# EAGLE design DummyLoad (EAGLE 7.3.0)
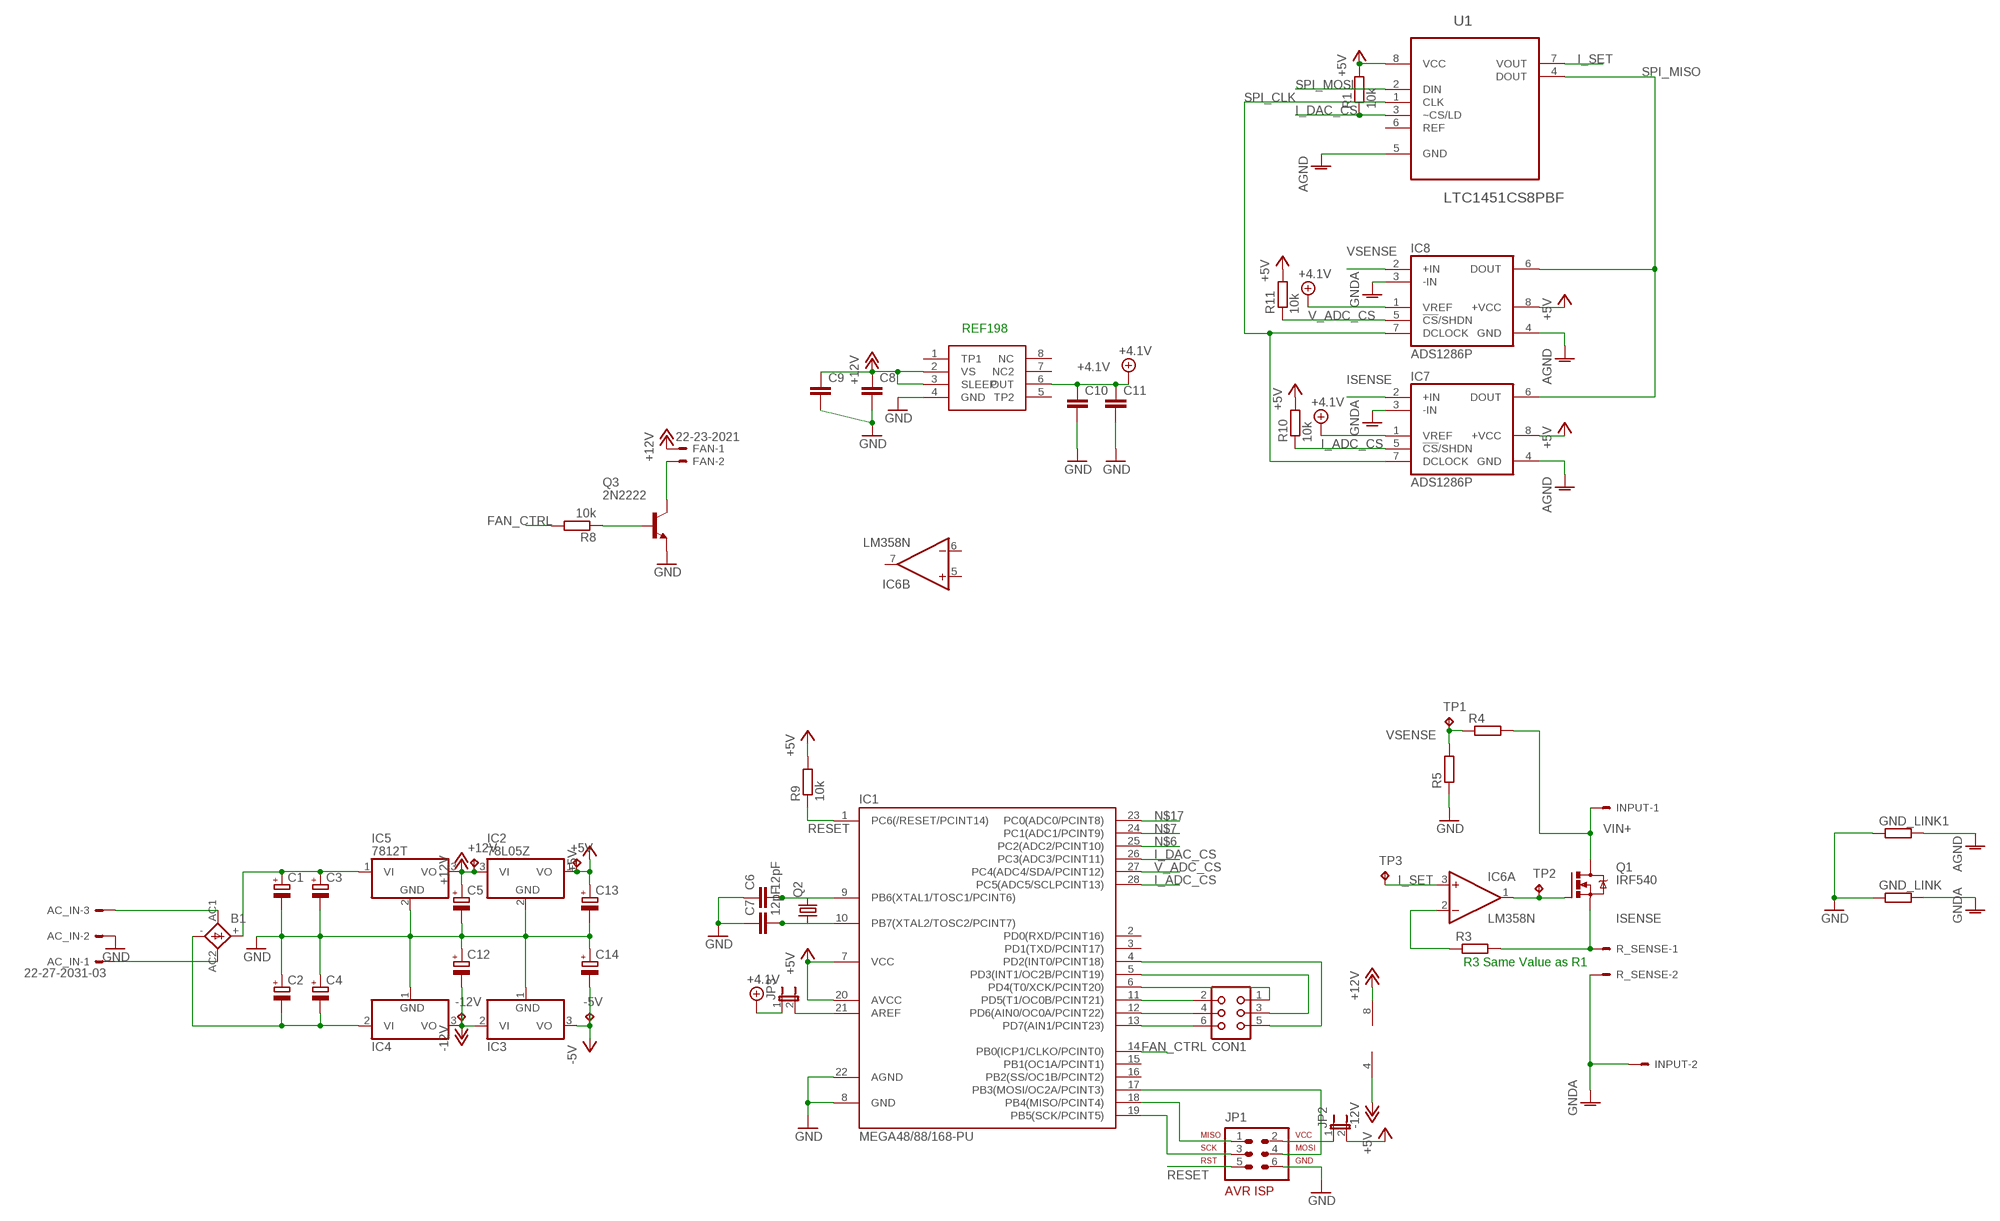
[diagram p0: schematic, sheet 1]

## Parts
+5V  TPB2,54  [B2,54]
+12V  TPB2,54  [B2,54]
-5V  TPB2,54  [B2,54]
-12V  TPB2,54  [B2,54]
AC_IN  22-27-2031-03  [6410-03]
B1  2KBB-R  [2KBB-R]
C1  CPOL-EUE5-8.5  [E5-8,5]
C2  CPOL-EUE5-8.5  [E5-8,5]
C3  CPOL-EUE5-8.5  [E5-8,5]
C4  CPOL-EUE5-8.5  [E5-8,5]
C5  CPOL-EUE2,5-6E  [E2,5-6E]
C6  12pF  C-EUC1206K  [C1206K]
C7  12pF  C-EUC1206K  [C1206K]
C8  C-EUC1206K  [C1206K]
C9  C-EUC1206K  [C1206K]
C10  C-EUC1206K  [C1206K]
C11  C-EUC1206K  [C1206K]
C12  CPOL-EUE2,5-6E  [E2,5-6E]
C13  CPOL-EUE2,5-6E  [E2,5-6E]
C14  CPOL-EUE2,5-6E  [E2,5-6E]
CON1  CON06  [CON06]
FAN  22-23-2021  [22-23-2021]
GND_LINK  R-EU_0204/2V  [0204V]
GND_LINK1  R-EU_0204/2V  [0204V]
IC1  MEGA48/88/168-PU  [DIL28-3]
IC2  78L05Z  [TO92]
IC3  79L05Z  [TO92]
IC4  7912T  [TO220H]
IC5  7812T  [TO220H]
IC6  LM358N  [DIL08]
IC7  ADS1286P  [DIL08]
IC8  ADS1286P  [DIL08]
INPUT  KK-156-2  [KK-156-2]
JP1  AVR-ISP-6VERT  [AVR-ISP-6]
JP2  JP1E  [JP1]
JP3  JP1E  [JP1]
Q1  IRF540  [TO220BV]
Q2  CRYSTALHC18U-V  [HC18U-V]
Q3  2N2222  [TO18]
R1  10k  R-EU_M1206  [M1206]
R3  R-EU_M1206  [M1206]
R4  R-EU_M1206  [M1206]
R5  R-EU_M1206  [M1206]
R8  10k  R-EU_0204/7  [0204/7]
R9  10k  R-EU_M1206  [M1206]
R10  10k  R-EU_M1206  [M1206]
R11  10k  R-EU_M1206  [M1206]
R_SENSE  KK-156-2  [KK-156-2]
TP1  TPB2,54  [B2,54]
TP2  TPB2,54  [B2,54]
TP3  TPB2,54  [B2,54]
U1  LTC1451CS8PBF  [SOIC127P600X175-8N]
U$1  REF195  [DIL08]

## Nets
+4.1V: C10.1 C11.1 IC7.1(VREF) IC8.1(VREF) JP3.1 U$1.6(OUT)
+5V: +5V.TP C13.+ IC1.7(VCC) IC1.20(AVCC) IC2.1(VO) IC7.8(+VCC) IC8.8(+VCC) JP2.2 R1.2 R9.2 R10.2 R11.2 U1.8(VCC)
+12V: +12V.TP C5.+ C8.1 C9.1 FAN.1 IC2.3(VI) IC5.3(VO) IC6.8(P:V+) U$1.2(VS) U$1.3(SLEEP)
-5V: -5V.TP C14.- IC3.3(VO)
-12V: -12V.TP C12.- IC3.2(VI) IC4.3(VO) IC6.4(P:V-)
AGND: GND_LINK1.2 IC7.4(GND) IC8.4(GND) U1.5(GND)
FAN_CTRL: IC1.14(PB0(ICP1/CLKO/PCINT0)) R8.2
GND: AC_IN.2 C1.- C2.+ C3.- C4.+ C5.- C6.1 C7.1 C8.2 C9.2 C10.2 C11.2 C12.+ C13.- C14.+ GND_LINK1.1 GND_LINK.1 IC1.8(GND) IC1.22(AGND) IC2.2(GND) IC3.1(GND) IC4.1(GND) IC5.2(GND) JP1.6 Q3.1(E) R5.1 U$1.4(GND)
GNDA: GND_LINK.2 IC7.3(-IN) IC8.3(-IN) INPUT.2 R_SENSE.2
I_ADC_CS: IC1.28(PC5(ADC5/SCLPCINT13)) IC7.5(!CS!/SHDN) R10.1
I_DAC_CS: IC1.26(PC3(ADC3/PCINT11)) R1.1 U1.3(~CS/LD)
I_SET: IC6.3(A:+IN) TP3.TP U1.7(VOUT)
ISENSE: IC7.2(+IN) Q1.S R3.2 R_SENSE.1
N$1: AC_IN.3 B1.AC1
N$2: AC_IN.1 B1.AC2
N$3: B1.+ C1.+ C3.+ IC5.1(VI)
N$4: IC6.1(A:OUT) Q1.G TP2.TP
N$5: IC1.21(AREF) JP3.2
N$6: IC1.25(PC2(ADC2/PCINT10))
N$7: IC1.24(PC1(ADC1/PCINT9))
N$8: B1.- C2.- C4.- IC4.2(VI)
N$9: CON1.2 IC1.11(PD5(T1/OC0B/PCINT21))
N$10: CON1.4 IC1.12(PD6(AIN0/OC0A/PCINT22))
N$11: CON1.6 IC1.13(PD7(AIN1/PCINT23))
N$12: CON1.1 IC1.6(PD4(T0/XCK/PCINT20))
N$13: CON1.3 IC1.5(PD3(INT1/OC2B/PCINT19))
N$14: C6.2 IC1.9(PB6(XTAL1/TOSC1/PCINT6)) Q2.2
N$15: C7.2 IC1.10(PB7(XTAL2/TOSC2/PCINT7)) Q2.1
N$16: CON1.5 IC1.4(PD2(INT0/PCINT18))
N$17: IC1.23(PC0(ADC0/PCINT8))
N$19: FAN.2 Q3.3(C)
N$20: Q3.2(B) R8.1
N$24: JP1.2 JP2.1
R_SENSE+: IC6.2(A:-IN) R3.1
RESET: IC1.1(PC6(/RESET/PCINT14)) JP1.5 R9.1
SPI_CLK: IC1.19(PB5(SCK/PCINT5)) IC7.7(DCLOCK) IC8.7(DCLOCK) JP1.3 U1.1(CLK)
SPI_MISO: IC1.18(PB4(MISO/PCINT4)) IC7.6(DOUT) IC8.6(DOUT) JP1.1 U1.4(DOUT)
SPI_MOSI: IC1.17(PB3(MOSI/OC2A/PCINT3)) JP1.4 U1.2(DIN)
V_ADC_CS: IC1.27(PC4(ADC4/SDA/PCINT12)) IC8.5(!CS!/SHDN) R11.1
VIN+: INPUT.1 Q1.D R4.2
VSENSE: IC8.2(+IN) R4.1 R5.2 TP1.TP
Unconnected: IC1.2(PD0(RXD/PCINT16)) IC1.3(PD1(TXD/PCINT17)) IC1.15(PB1(OC1A/PCINT1)) IC1.16(PB2(SS/OC1B/PCINT2)) IC6.5(B:+IN) IC6.6(B:-IN) IC6.7(B:OUT) U1.6(REF) U$1.1(TP1) U$1.5(TP2) U$1.7(NC2) U$1.8(NC)

## Notes on the sheet
- REF198
- R3 Same Value as R1

## Library data of the parts
+5V +12V -5V -12V TP1-TP3 = testpad:TP: Test pad
AC_IN = con-molex:22-?-03: CONNECTOR wire to board 2.54 mm (.1 inch) pitch header; OC_FARNELL: unknown; OC_NEWARK: unknown
B1 = rectifier:2KBB-R: RECTIFIER grid 3 x 5 mm
C1-C5 C12-C14 = rcl:CPOL-EU: POLARIZED CAPACITOR, European symbol
C6-C11 = rcl:C-EU: CAPACITOR, European symbol
CON1 = con-harting:CON06: CONNECTOR; OC_FARNELL: unknown; OC_NEWARK: unknown
FAN = con-molex:22-23-2021: .100" (2.54mm) Center Header - 2 Pin; MF: MOLEX; MPN: 22-23-2021; OC_FARNELL: 1462926; OC_NEWARK: 25C3832
GND_LINK GND_LINK1 R1 R3-R5 R8-R11 = resistor:R-EU_: RESISTOR, European symbol
IC1 = avr-7:MEGA48/88/168-PU
IC2 IC5 = linear:78*: Positive VOLTAGE REGULATOR Source: http://cache.national.com/ds/LM/LM78L05.pdf http://www.fairchildsemi.com/ds/LM/LM7805.pdf
IC3 IC4 = linear:79*: Negative VOLTAGE REGULATOR
IC6 = linear:LM358: OP AMP also LM158; LM258; LM2904 Source: http://cache.national.com/ds/LM/LM158.pdf
IC7 IC8 = burr-brown:ADS1286: 12-Bit Micro Power Sampling ADC; MF: TEXAS INSTRUMENT CONNECTORS; MPN: ADS1286P; OC_FARNELL: 1214453; OC_NEWARK: 74C7011
INPUT R_SENSE = con-molex:KK-156-2: KK 156 HEADER Source: http://www.molex.com/pdm_docs/sd/026604100_sd.pdf; OC_FARNELL: unknown; OC_NEWARK: unknown
JP1 = avr-7:AVR-ISP-6: AVR ISP-6 Serial Programming Header
JP2 JP3 = jumper:JP1E: JUMPER
Q1 = transistor-power:IRF540: HEXFET Power MOSFET
Q2 = crystal:CRYSTAL: CRYSTAL; OC_FARNELL: unknown; OC_NEWARK: unknown
Q3 = transistor-npn:2N2222*: NPN Transistor
U1 = LTC_By_element14_Batch_1:LTC1451CS8PBF: 12-Bit Rail-to-Rail Micropower DAC; MPN: LTC1451CS8#PBF; OC_FARNELL: 9561188; OC_NEWARK: 56M1343; PACKAGE: SOIC-8; SUPPLIER: Linear Technology
U$1 = mylibrary:REF195

## Board
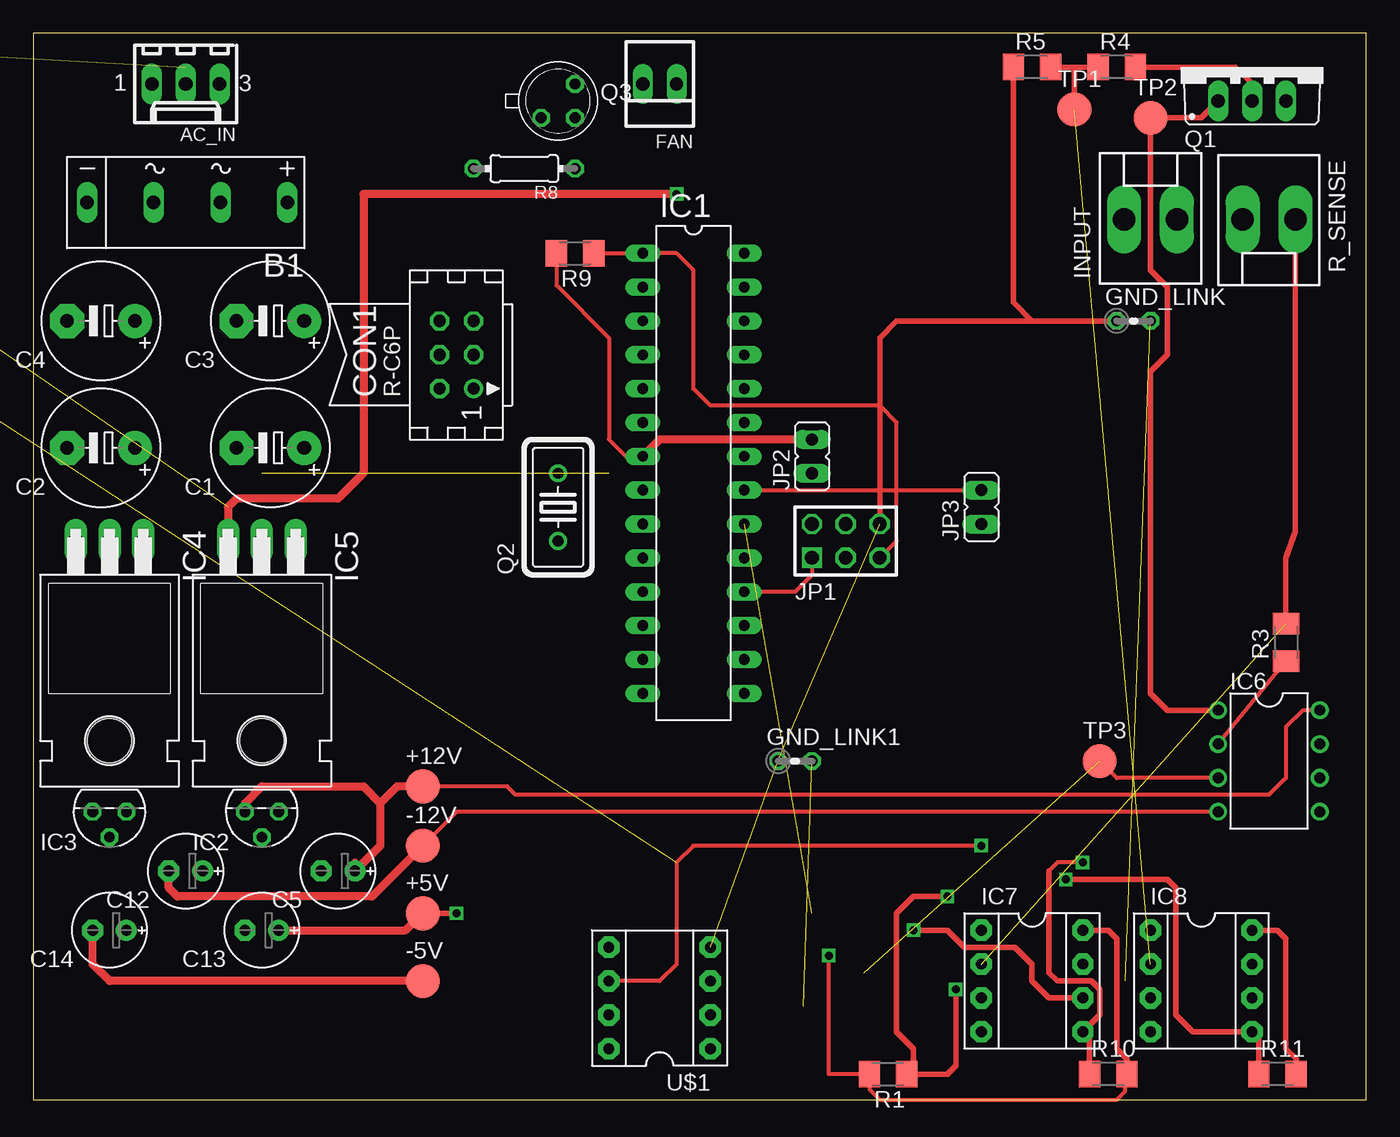
[diagram p1: board, top side]
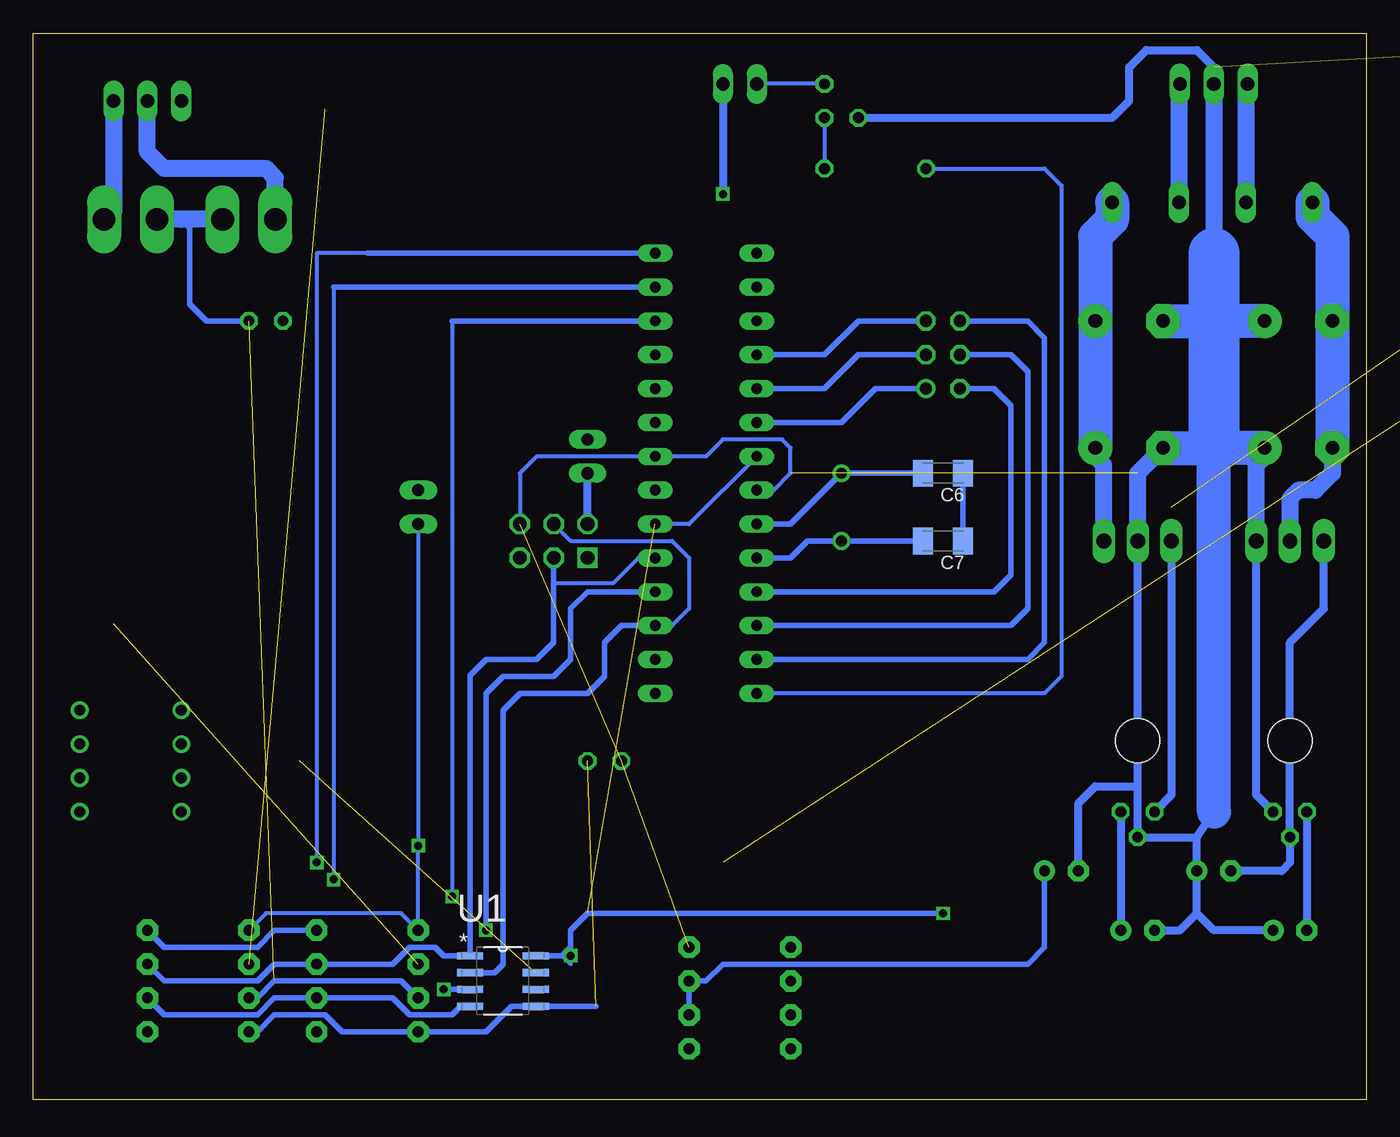
[diagram p2: board, bottom side, seen from below]

Size 100 x 80 mm. Coordinates in mm from the lower left corner, seen from the top.
Outline: 0,0 100,0 100,80 0,80 0,0
Copper layers (1*16): Top 0.035mm / dielectric 1.5mm / Bottom 0.035mm
Design rules "default": minimum track width 10mil, minimum drill 24mil, track to track 8mil, track to pad 8mil, pad to pad 8mil, via to via 8mil, smd to smd 8mil, copper to edge 40mil, drill to drill 8mil, minimum pad ring 10mil, minimum via ring 8mil, stop-mask expansion 4mil, vias tented up to drill 0mil, thermal gap 10mil

### Footprints (pad centres in the part's own frame; a part is rotated, then mirrored left to right if it is on the bottom)
B2,54 = smd 2.54 x 2.54: TP 0,0
6410-03 = drill 1.016 long: 1 2.54,0; 2 0,0; 3 -2.54,0
2KBB-R = drill 1.016 long: + -7.62,0; - 7.391,0; AC1 -2.616,0; AC2 2.413,0
E5-8,5 = drill 1.016 pad 2.54: + -2.54,0 | drill 1.016 pad 2.54 octagon: - 2.54,0
E2,5-6E = drill 0.813 pad 1.575: + -1.27,0 | drill 0.813 pad 1.575 octagon: - 1.27,0
C1206K = smd 1.5 x 2: 1 -1.5,0; 2 1.5,0
CON06 = drill 0.914: 1 -2.54,-1.27 | drill 0.914 octagon: 2 -2.54,1.27; 3 0,-1.27; 4 0,1.27; 5 2.54,-1.27; 6 2.54,1.27
22-23-2021 = drill 1 long: 1 -1.27,0; 2 1.27,0
0204V = drill 0.813 octagon: 1 -1.27,0; 2 1.27,0
DIL28-3 = drill 0.813 long: 1 -16.51,-3.81; 2 -13.97,-3.81; 3 -11.43,-3.81; 4 -8.89,-3.81; 5 -6.35,-3.81; 6 -3.81,-3.81; 7 -1.27,-3.81; 8 1.27,-3.81; 9 3.81,-3.81; 10 6.35,-3.81; 11 8.89,-3.81; 12 11.43,-3.81; 13 13.97,-3.81; 14 16.51,-3.81; 15 16.51,3.81; 16 13.97,3.81; 17 11.43,3.81; 18 8.89,3.81; 19 6.35,3.81; 20 3.81,3.81; 21 1.27,3.81; 22 -1.27,3.81; 23 -3.81,3.81; 24 -6.35,3.81; 25 -8.89,3.81; 26 -11.43,3.81; 27 -13.97,3.81; 28 -16.51,3.81
TO92 = drill 0.813 octagon: 1 -1.27,0; 2 0,1.905; 3 1.27,0
TO220H = drill 1.118 long: 1 -2.54,-10.16; 2 0,-10.16; 3 2.54,-10.16 | hole 3.302: 0,4.826
DIL08 = drill 0.813 pad 1.27: 1 -3.81,-3.81; 2 -1.27,-3.81; 3 1.27,-3.81; 4 3.81,-3.81; 5 3.81,3.81; 6 1.27,3.81; 7 -1.27,3.81; 8 -3.81,3.81
DIL08' = drill 0.813 pad 1.6 octagon: 1 -3.81,-3.81; 2 -1.27,-3.81; 3 1.27,-3.81; 4 3.81,-3.81; 5 3.81,3.81; 6 1.27,3.81; 7 -1.27,3.81; 8 -3.81,3.81
KK-156-2 = drill 1.7 pad 2.184 long: 1 -1.98,0; 2 1.98,0
AVR-ISP-6 = drill 1.016 square: 1 -2.54,-1.27 | drill 1.016 octagon: 2 -2.54,1.27; 3 0,-1.27; 4 0,1.27; 5 2.54,-1.27; 6 2.54,1.27
JP1 = drill 0.914 long: 1 0,-1.27; 2 0,1.27
TO220BV = drill 1.016 long: D 0,-2.54; G -2.54,-2.54; S 2.54,-2.54
HC18U-V = drill 0.813: 1 -2.54,0; 2 2.54,0
TO18 = drill 0.813 octagon: 1 -1.27,-1.27; 2 1.27,-1.27; 3 1.27,1.27
M1206 = smd 1.6 x 2: 1 -1.4,0; 2 1.4,0
0204/7 = drill 0.813 octagon: 1 -3.81,0; 2 3.81,0
SOIC127P600X175-8N = smd 1.981 x 0.533: 1 -2.464,1.905; 2 -2.464,0.635; 3 -2.464,-0.635; 4 -2.464,-1.905; 5 2.464,-1.905; 6 2.464,-0.635; 7 2.464,0.635; 8 2.464,1.905

### Placement (x,y rotation side)
+5V  29.21,13.97 0 top
+12V  29.21,23.5 0 top
-5V  29.21,8.89 0 top
-12V  29.21,19.05 0 top
AC_IN  11.43,76.2 180 top
B1  11.43,67.31 180 top
C1  17.78,48.9 180 top
C2  5.08,48.9 180 top
C3  17.78,58.42 180 top
C4  5.08,58.42 180 top
C5  22.86,17.14 180 top
C6  31.75,46.99 180 bottom
C7  31.75,41.91 180 bottom
C8  -35.56,80.01 0 top  (outside the outline)
C9  -40.64,80.01 0 top  (outside the outline)
C10  -45.72,80.01 0 top  (outside the outline)
C11  -50.8,80.01 0 top  (outside the outline)
C12  11.43,17.14 180 top
C13  17.14,12.7 180 top
C14  5.71,12.7 180 top
CON1  31.75,55.88 90 top
FAN  46.99,76.2 180 top
GND_LINK  82.55,58.42 0 top
GND_LINK1  57.15,25.4 0 top
IC1  49.53,46.99 270 top
IC2  17.14,21.59 180 top
IC3  5.71,21.59 180 top
IC4  5.71,31.75 180 top
IC5  17.14,31.75 180 top
IC6  92.71,25.4 270 top
IC7  ADS1286P  [DIL08']  74.93,8.89 270 top
IC8  ADS1286P  [DIL08']  87.63,8.89 270 top
INPUT  83.82,66.04 0 top
JP1  60.96,41.91 0 top
JP2  58.42,48.26 0 top
JP3  71.12,44.45 0 top
Q1  91.44,77.47 0 top
Q2  39.37,44.45 90 top
Q3  39.37,74.93 0 top
R1  64.14,1.91 180 top
R3  93.98,34.29 90 top
R4  81.28,77.47 0 top
R5  74.93,77.47 0 top
R8  36.83,69.85 180 top
R9  40.64,63.5 180 top
R10  80.64,1.91 0 top
R11  93.34,1.91 0 top
R_SENSE  92.71,66.04 180 top
TP1  78.11,74.3 0 top
TP2  83.82,73.66 0 top
TP3  80.01,25.4 0 top
U1  64.77,8.89 0 bottom
U$1  REF195  [DIL08']  46.99,7.62 90 top

### Tracks (layer width: path | path; a pad name or v marks a point on that pad's centre or on a via)
+4.1V  (via drill 0.6)  (2 unrouted)
  Top 0.305: v71.12,19.05 49.53,19.05 48.26,17.78 48.26,10.16 46.99,8.89 U$1.6
  Bottom 0.305: JP3.1 v71.12,19.05 IC7.1 72.39,13.97 82.55,13.97 IC8.1
+5V  (via drill 0.6)  (1 unrouted)
  Top 0.305: R10.2 81.92,1.77 81.92,0.64 81.28,0 63.5,0 62.73,0.77 R1.2 59.69,1.91 v59.69,10.79 | R9.2 39.24,61.09 43.18,57.15 43.18,49.53 44.45,48.26 IC1.7
  Top 0.406: R10.2 82.05,3.04 81.28,3.81 81.28,12.06 80.64,12.7 IC7.8 | R11.2 94.75,3.04 93.98,3.81 93.98,12.06 93.34,12.7 IC8.8 | v31.75,13.97 +5V.TP
  Top 0.61: C13.+ 27.94,12.7 +5V.TP | JP2.2 46.99,49.53 IC1.7
  Bottom 0.305: v59.69,10.79 59.69,10.16 60.33,10.79 | IC1.7 50.8,43.18 IC1.20
  Bottom 0.406: IC8.8 90.17,11.43 83.19,11.43 81.92,12.7 IC7.8 | U1.8 60.33,10.79 59.69,11.43 59.69,12.7 58.42,13.97 v31.75,13.97
  Bottom 0.61: IC2.1 C13.+
+12V  (via drill 0.6)  (2 unrouted)
  Top 0.305: IC6.8 95.25,29.21 93.98,27.94 93.98,24.13 92.71,22.86 36.2,22.86 35.56,23.5 +12V.TP
  Top 0.61: +12V.TP 27.3,23.5 26.04,22.23 | 26.04,22.23 26.04,19.05 C5.+ 24.13,17.78 | IC2.3 15.88,22.23 17.14,23.5 24.77,23.5 26.04,22.23 | v48.26,67.94 24.77,67.94 24.77,46.99 22.86,45.09 15.24,45.09 14.61,44.45 IC5.3
  Bottom 0.406: C5.+ 24.13,11.43 25.4,10.16 48.26,10.16 49.53,8.89 U$1.3 U$1.2
  Bottom 0.61: IC5.3 14.61,22.86 IC2.3 | FAN.1 v48.26,67.94
-5V
  Top 0.61: -5V.TP 5.71,8.89 4.45,10.16 C14.-
  Bottom 0.61: IC3.3 C14.-
-12V
  Top 0.305: IC6.4 31.75,21.59 -12V.TP
  Top 0.61: -12V.TP 25.4,15.24 10.79,15.24 10.16,15.88 C12.-
  Bottom 0.61: IC4.3 3.17,36.83 5.71,34.29 IC3.2 5.71,17.78 6.35,17.14 C12.-
AGND  (1 unrouted)
  Bottom 0.406: IC8.4 83.19,5.08 81.92,6.35 78.11,6.35 76.83,5.08 IC7.4 66.04,5.08 64.14,6.99 U1.5 57.78,6.99
FAN_CTRL
  Bottom 0.305: R8.2 24.13,69.85 22.86,68.58 22.86,31.75 24.13,30.48 IC1.14
GND  (8 unrouted)
  Top 0.406: R5.1 73.53,59.82 74.93,58.42 GND_LINK.1 64.77,58.42 63.5,57.15 JP1.6
  Bottom 0.305: JP1.6 63.5,46.99 62.23,48.26 IC1.22 49.53,48.26 48.26,49.53 43.81,49.53 43.18,48.9 43.18,46.99 44.45,45.72 IC1.8
  Bottom 0.406: C6.1 C7.1
  Bottom 0.61: 17.14,23.5 IC2.2 12.7,19.68 | 17.14,23.5 IC5.2 | IC3.1 8.26,22.86 IC4.1 | 12.7,19.68 C12.+ 12.7,13.97 | 12.7,19.68 11.43,21.59 | C14.+ 11.43,12.7 12.7,13.97 | C13.- 13.97,12.7 12.7,13.97 | C5.- 21.59,22.23 20.32,23.5 17.14,23.5 | Q3.1 19.05,73.66 17.78,74.93 17.78,77.47 16.51,78.74 12.7,78.74 11.43,77.47 AC_IN.2
  Bottom 1.27: AC_IN.2 11.43,63.5 | IC4.1 8.26,47.62 7.62,48.26 C2.+ | IC5.2 17.14,46.99 C1.-
  Bottom 2.54: C2.+ 11.43,48.9 | 11.43,48.9 11.43,49.53 | C1.- 11.43,48.9 | C4.+ 11.43,58.42 C3.- | 11.43,21.59 11.43,48.9
  Bottom 3.81: 11.43,63.5 11.43,58.42 11.43,49.53
GNDA  (1 unrouted)
  Bottom 0.406: IC7.3 72.39,8.89 81.92,8.89 83.19,7.62 IC8.3 | GND_LINK.2 87,58.42 88.27,59.69 88.27,65.41 88.9,66.04
  Bottom 1.27: INPUT.2 88.9,66.04 R_SENSE.2
I_ADC_CS  (via drill 0.6)
  Top 0.305: v78.74,17.78 76.83,17.78 76.2,17.14
  Top 0.406: R10.1 79.25,4.58 IC7.5 80.01,6.35 80.01,8.26 79.38,8.89 76.83,8.89 76.2,9.53 76.2,17.14
  Bottom 0.305: 74.93,63.5 78.74,63.5 v78.74,17.78
  Bottom 0.406: IC1.28 74.93,63.5
I_DAC_CS  (via drill 0.6)
  Top 0.406: v69.22,8.26 69.22,2.54 68.58,1.91 66.04,1.91 | 66.04,1.91 R1.1 | v68.58,15.24 66.04,15.24 64.77,13.97 64.77,5.08 66.04,3.81 66.04,1.91
  Bottom 0.305: 68.58,58.42 v68.58,15.24
  Bottom 0.406: U1.3 v69.22,8.26 | IC1.26 68.58,58.42
I_SET  (1 unrouted)
  Top 0.305: IC6.3 81.28,24.13 TP3.TP
ISENSE  (1 unrouted)
  Top 0.406: R_SENSE.1 94.69,42.62 93.98,40.64 R3.2
  Bottom 1.27: Q1.S 93.98,66.6 R_SENSE.1
N$1
  Bottom 1.27: AC_IN.3 14.05,76.2 B1.AC1
N$2
  Bottom 1.27: AC_IN.1 9.02,76.2 B1.AC2
N$3
  Bottom 1.27: IC5.1 19.68,47.62 20.32,48.26 C1.+
  Bottom 2.54: B1.+ 19.05,66.04 20.32,64.77 C3.+ C1.+
N$4
  Top 0.406: Q1.G 87.63,73.66 TP2.TP 83.82,62.23 85.09,60.96 85.09,55.88 83.82,54.61 83.82,30.48 85.09,29.21 IC6.1
N$5
  Top 0.305: IC1.21 JP3.2
N$8
  Bottom 1.27: C2.- 2.54,46.99 3.81,45.72 5.08,45.72 5.71,45.09 IC4.2
  Bottom 2.54: B1.- 4.04,66.27 2.54,64.77 C4.- C2.-
N$9
  Bottom 0.406: CON1.2 27.94,53.34 26.67,52.07 26.67,39.37 27.94,38.1 IC1.11
N$10
  Bottom 0.406: CON1.4 26.67,55.88 25.4,54.61 25.4,36.83 26.67,35.56 IC1.12
N$11
  Bottom 0.406: IC1.13 25.4,33.02 24.13,34.29 24.13,57.15 25.4,58.42 CON1.6
N$12
  Bottom 0.406: CON1.1 36.83,53.34 39.37,50.8 IC1.6
N$13
  Bottom 0.406: CON1.3 38.1,55.88 40.64,53.34 IC1.5
N$14
  Bottom 0.406: IC1.9 43.18,43.18 Q2.2 C6.2
N$15
  Bottom 0.406: IC1.10 43.18,40.64 41.91,41.91 Q2.1 C7.2
N$16
  Bottom 0.406: CON1.5 38.1,58.42 40.64,55.88 IC1.4
N$19
  Bottom 0.305: Q3.3 FAN.2
N$20
  Bottom 0.305: Q3.2 R8.1
N$24
  Bottom 0.61: JP1.2 JP2.1
R_SENSE+
  Top 0.305: R3.1 88.77,26.54 IC6.2
RESET
  Top 0.305: R9.1 IC1.1 48.26,63.5 49.53,62.23 49.53,53.34 50.8,52.07 63.5,52.07 64.77,50.8 64.77,41.91 JP1.5
SPI_CLK
  Bottom 0.305: IC1.19 54.61,40.64 56.52,38.73 60.96,38.73
  Bottom 0.406: IC8.7 90.17,8.89 83.19,8.89 81.92,10.16 IC7.7 73.03,10.16 71.75,11.43 69.85,11.43 69.22,10.79 U1.1 67.23,31.83 66.04,33.02 62.23,33.02 60.96,34.29 60.96,38.73 JP1.3
SPI_MISO  (via drill 0.6)
  Top 0.305: JP1.1 58.42,39.37 57.15,38.1 IC1.18
  Top 0.406: v66.04,12.7 68.58,12.7 69.85,11.43 73.66,11.43 74.93,10.16 74.93,8.89 76.2,7.62 IC7.6
  Bottom 0.406: IC8.6 90.17,6.35 83.19,6.35 81.92,7.62 IC7.6 73.03,7.62 71.75,6.35 68.58,6.35 67.94,6.99 U1.4 | IC1.18 58.42,38.1 59.69,36.83 59.69,33.02 60.96,31.75 64.77,31.75 66.04,30.48 v66.04,12.7
SPI_MOSI
  Bottom 0.305: JP1.4 59.69,41.91 52.07,41.91 50.8,40.64 50.8,36.83 52.07,35.56 IC1.17
  Bottom 0.406: IC1.17 55.88,35.56 57.15,34.29 57.15,31.75 58.42,30.48 63.5,30.48 64.77,29.21 64.77,10.16 65.41,9.53 U1.2
V_ADC_CS  (via drill 0.6)
  Top 0.406: R11.1 91.94,4.58 IC8.5 87,5.08 85.72,6.35 85.72,15.88 85.09,16.51 v77.47,16.51
  Bottom 0.305: 77.47,60.96 v77.47,16.51
  Bottom 0.406: IC1.27 77.47,60.96
VIN+
  Top 0.406: R4.2 90.17,77.47 91.44,76.2 Q1.D
  Bottom 1.27: INPUT.1 81.84,69.14 82.55,69.85 90.17,69.85 91.44,71.12 Q1.D
VSENSE  (1 unrouted)
  Top 0.406: R5.2 78.11,77.47 | 78.11,77.47 R4.1 | TP1.TP 78.11,77.47